# Altium schematic sheet cp2102_usbC.SchDoc
size A3
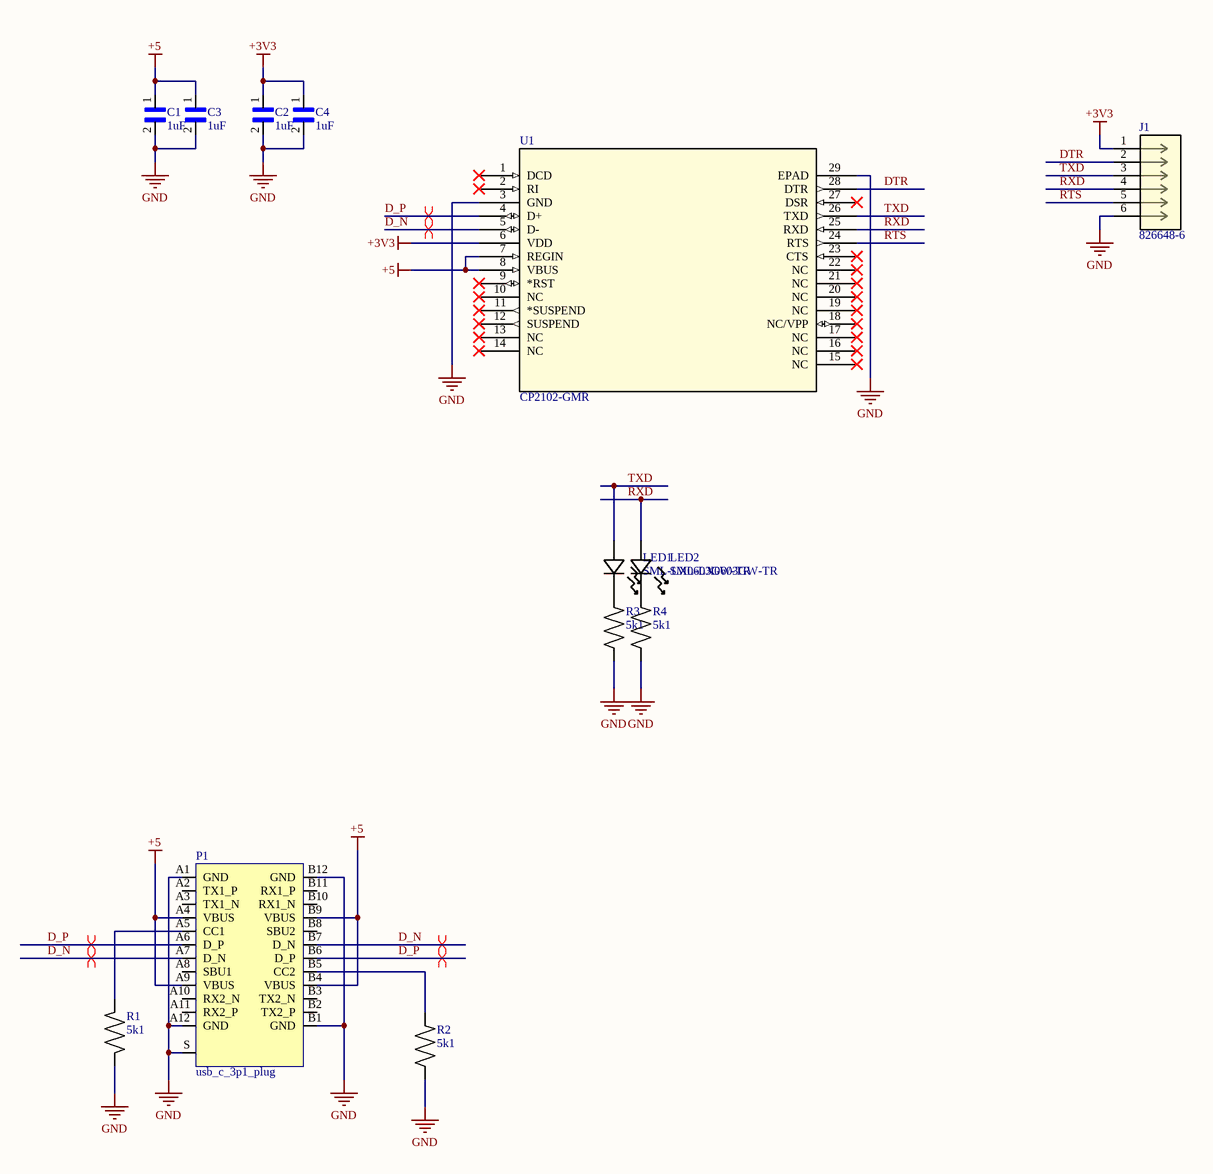
[diagram p0: cp2102_usbC.SchDoc]

## Parts
C1  1uF  [*CAPC1608X90N]
C2  1uF  [*CAPC1608X90N]
C3  1uF  [*CAPC1608X90N]
C4  1uF  [*CAPC1608X90N]
J1  826648-6  [CONN6_826648-6_TEC]
LED1  SML-LX0603GW-TR  [LED_SML-LX0603GW-TR_LUM]
LED2  SML-LX0603GW-TR  [LED_SML-LX0603GW-TR_LUM]
P1  usb_c_3p1_plug  [PCBComponent_1]
R1  5k1  [*RESC1608X55N]
R2  5k1  [*RESC1608X55N]
R3  5k1  [*RESC1608X55N]
R4  5k1  [*RESC1608X55N]
U1  CP2102-GMR  [QFN28_5X5_SIL]

## Nets
+3V3: C2.1 C4.1 J1.1 U1.6(VDD)
+5: C1.1 C3.1 P1.A4(VBUS) P1.A9(VBUS) P1.B4(VBUS) P1.B9(VBUS) U1.7(REGIN) U1.8(VBUS)
GND: C1.2 C2.2 C3.2 C4.2 J1.6 P1.A1(GND) P1.A12(GND) P1.B1(GND) P1.B12(GND) P1.S(SHIELD) R1.1 R2.1 R3.1 R4.1 U1.3(GND) U1.29(EPAD)
D_N: P1.A7(D_N) P1.B7(D_N) U1.5(D-)
D_P: P1.A6(D_P) P1.B6(D_P) U1.4(D+)
DTR: J1.2 U1.28(DTR)
RTS: J1.5 U1.24(RTS)
RXD: J1.4 LED2.2 U1.25(RXD)
TXD: J1.3 LED1.2 U1.26(TXD)
NetLED1_1: LED1.1 R3.2
NetLED2_1: LED2.1 R4.2
NetP1_A5: P1.A5(CC1) R1.2
NetP1_B5: P1.B5(CC2) R2.2

Not connected (* = marked no-connect by the designer): P1 A2(TX1_P) A3(TX1_N) A8(SBU1) A10(RX2_N) A11(RX2_P) B2(TX2_P) B3(TX2_N) B8(SBU2) B10(RX1_N) B11(RX1_P); U1 1(DCD)* 2(RI)* 9(*RST)* 10(NC)* 11(*SUSPEND)* 12(SUSPEND)* 13(NC)* 14(NC)* 15(NC)* 16(NC)* 17(NC)* 18(NC/VPP)* 19(NC)* 20(NC)* 21(NC)* 22(NC)* 23(CTS)* 27(DSR)*

## Layout directives
differential pair; differential pair class USB_D: D_N, D_P

## Library data of the parts
C1-C4 = 06033C103KAT2A: 0603 10 nF 25 V 10% Tolerance X7R Surface Mount Multilayer Ceramic Capacitor; MF: AVX; Package: 1608 AVX; MP: 06033C103KAT2A; Price: None; Availability: Unavailable; SnapEDA_Link: https://www.snapeda.com/parts/06033C103KAT2A/AVX%20/%20Kyocera/view-part/?ref=snap; Value: *
J1 = 826648-6: 6P AMPMODU II STIFT LEI; Built_By: EMA_Justin; Vendor: TE Connectivity; ROWS/CONFIG: 1; PITCH(MM): 2.54; POSITIONS: 6; SourceLibrary: TE_Connectivity_250_Part_Delivery_4_2018-09-04; Copyright: Copyright (C) 2016 Accelerated Designs. All rights reserved; Manufacturer_Part_Number: 826648-6; TE_Part_Number: 826648-6; PRODUCT: Connector; Type: DEV; Datasheet: https://www.te.com/commerce/DocumentDelivery/DDEController?Action=showdoc&DocId=Customer+Drawing%7F826629%7FAC%7Fpdf%7FEnglish%7FENG_CD_826629_AC.pdf%7F826648-6; RefDes: RefDes
LED1 LED2 = SML-LX0603GW-TR: No Description Available; Vendor: Lumex; Built_By: EMA_Cory; SourceLibrary: Lumex_2020-09-08; Type: DEV; Datasheet: https://www.lumex.com/spec/SML-LX0603GW-TR.pdf; Manufacturer_Part_Number: SML-LX0603GW-TR; Copyright: Copyright (C) 2018 Accelerated Designs. All rights reserved; RefDes: RefDes
R1-R4 = CR0603-FX-4701ELF: Res Thick Film 0603 4.7K Ohm 1% 1/10W 100ppm/C Molded SMD SMD Paper Tape on Plastic Reel; MF: Bourns; MP: CR0603-FX-4701ELF; Package: 1608 Rohm Semiconductor; Price: None; SnapEDA_Link: https://www.snapeda.com/parts/CR0603-FX-4701ELF/Bourns/view-part/?ref=snap; Availability: Unavailable; Value: *
U1 = CP2102-GMR: No Description Available; Vendor: Silicon Labs; Built_By: EMA_UL_Team; SourceLibrary: Silicon_Labs_2018-12-15; Manufacturer_Part_Number: CP2102-GMR; Copyright: Copyright (C) 2018 Accelerated Designs. All rights reserved; RefDes: RefDes; Type: DEV